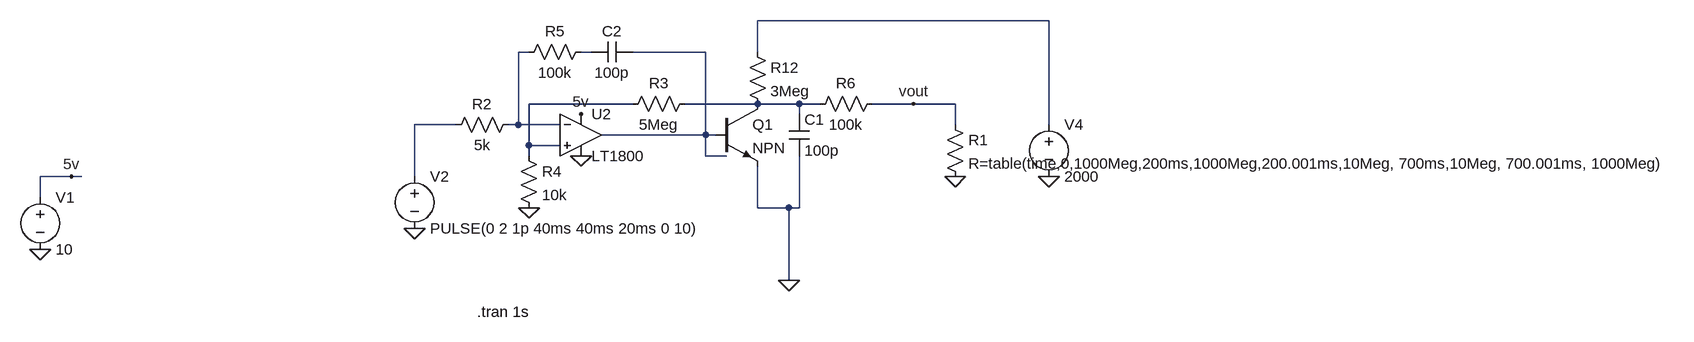
[diagram p0: schematic FOCUS_AMP.asc]
FOCUS_AMP.asc, the LTspice schematic file:
Version 4
SHEET 1 2456 680
WIRE 1472 80 1024 80
WIRE 672 128 656 128
WIRE 768 128 752 128
WIRE 944 128 832 128
WIRE 1024 128 1024 80
WIRE 832 208 672 208
WIRE 1024 208 912 208
WIRE 1088 208 1024 208
WIRE 1120 208 1088 208
WIRE 1264 208 1200 208
WIRE 1328 208 1264 208
WIRE 1088 224 1088 208
WIRE 560 240 496 240
WIRE 656 240 656 128
WIRE 656 240 640 240
WIRE 720 240 656 240
WIRE 1328 240 1328 208
WIRE 1472 240 1472 80
WIRE 944 256 944 128
WIRE 944 256 784 256
WIRE 960 256 944 256
WIRE 672 272 672 208
WIRE 720 272 672 272
WIRE 672 288 672 272
WIRE 944 288 944 256
WIRE 976 288 944 288
WIRE -32 320 -80 320
WIRE -16 320 -32 320
WIRE 496 320 496 240
WIRE -80 352 -80 320
WIRE 1024 368 1024 304
WIRE 1072 368 1024 368
WIRE 1088 368 1088 288
WIRE 1088 368 1072 368
WIRE 1072 480 1072 368
FLAG -80 432 0
FLAG -32 320 5v
FLAG 752 224 5v
FLAG 1072 480 0
FLAG 1472 320 0
FLAG 752 288 0
FLAG 496 400 0
FLAG 1328 320 0
FLAG 672 368 0
FLAG 1264 208 vout
SYMBOL Voltage -80 336 R0
SYMATTR InstName V1
SYMATTR Value 10
SYMBOL OpAmps/LT1800 752 192 R0
SYMATTR InstName U2
SYMBOL Res 1008 112 R0
SYMATTR InstName R12
SYMATTR Value 3Meg
SYMBOL Voltage 1472 224 R0
SYMATTR InstName V4
SYMATTR Value 2000
SYMBOL Voltage 496 304 R0
SYMATTR InstName V2
SYMATTR Value PULSE(0 2 1p 40ms 40ms 20ms 0 10)
SYMBOL Res 1312 224 R0
SYMATTR InstName R1
SYMATTR Value R=table(time,0,1000Meg,200ms,1000Meg,200.001ms,10Meg, 700ms,10Meg, 700.001ms, 1000Meg)
SYMBOL Res 928 192 R90
WINDOW 0 0 56 VBottom 2
WINDOW 3 32 56 VTop 2
SYMATTR InstName R3
SYMATTR Value 5Meg
SYMBOL Res 656 224 R90
WINDOW 0 0 56 VBottom 2
WINDOW 3 32 56 VTop 2
SYMATTR InstName R2
SYMATTR Value 5k
SYMBOL Res 656 272 R0
SYMATTR InstName R4
SYMATTR Value 10k
SYMBOL Cap 1072 224 R0
SYMATTR InstName C1
SYMATTR Value 100p
SYMBOL Cap 832 112 R90
WINDOW 0 0 32 VBottom 2
WINDOW 3 32 32 VTop 2
SYMATTR InstName C2
SYMATTR Value 100p
SYMBOL Res 768 112 R90
WINDOW 0 0 56 VBottom 2
WINDOW 3 32 56 VTop 2
SYMATTR InstName R5
SYMATTR Value 100k
SYMBOL npn 960 208 R0
SYMATTR InstName Q1
SYMBOL Res 1216 192 R90
WINDOW 0 0 56 VBottom 2
WINDOW 3 32 56 VTop 2
SYMATTR InstName R6
SYMATTR Value 100k
TEXT 592 528 Left 2 !.tran 1s

The netlist it stands for:
* FOCUS_AMP.asc
V1 5v 0 10
XU2 N005 N002 5v 0 N004 LT1800  ; pins In+ In- V+ V- OUT
R12 N001 N006 3Meg
V4 N001 0 2000
V2 N007 0 PULSE(0 2 1p 40ms 40ms 20ms 0 10)
R1 vout 0 R=table(time,0,1000Meg,200ms,1000Meg,200.001ms,10Meg, 700ms,10Meg, 700.001ms, 1000Meg)
R3 N006 N005 5Meg
R2 N002 N007 5k
R4 N005 0 10k
C1 N006 0 100p
C2 N004 N003 100p
R5 N003 N002 100k
Q1 N006 N004 0 0 NPN
R6 vout N006 100k
.model NPN NPN
.model PNP PNP
.lib standard.bjt
.tran 1s
.backanno
.end